# EAGLE design LTC6811_slave_12s_rev0 (EAGLE 9.3.1)

## Sheet 1 of 2
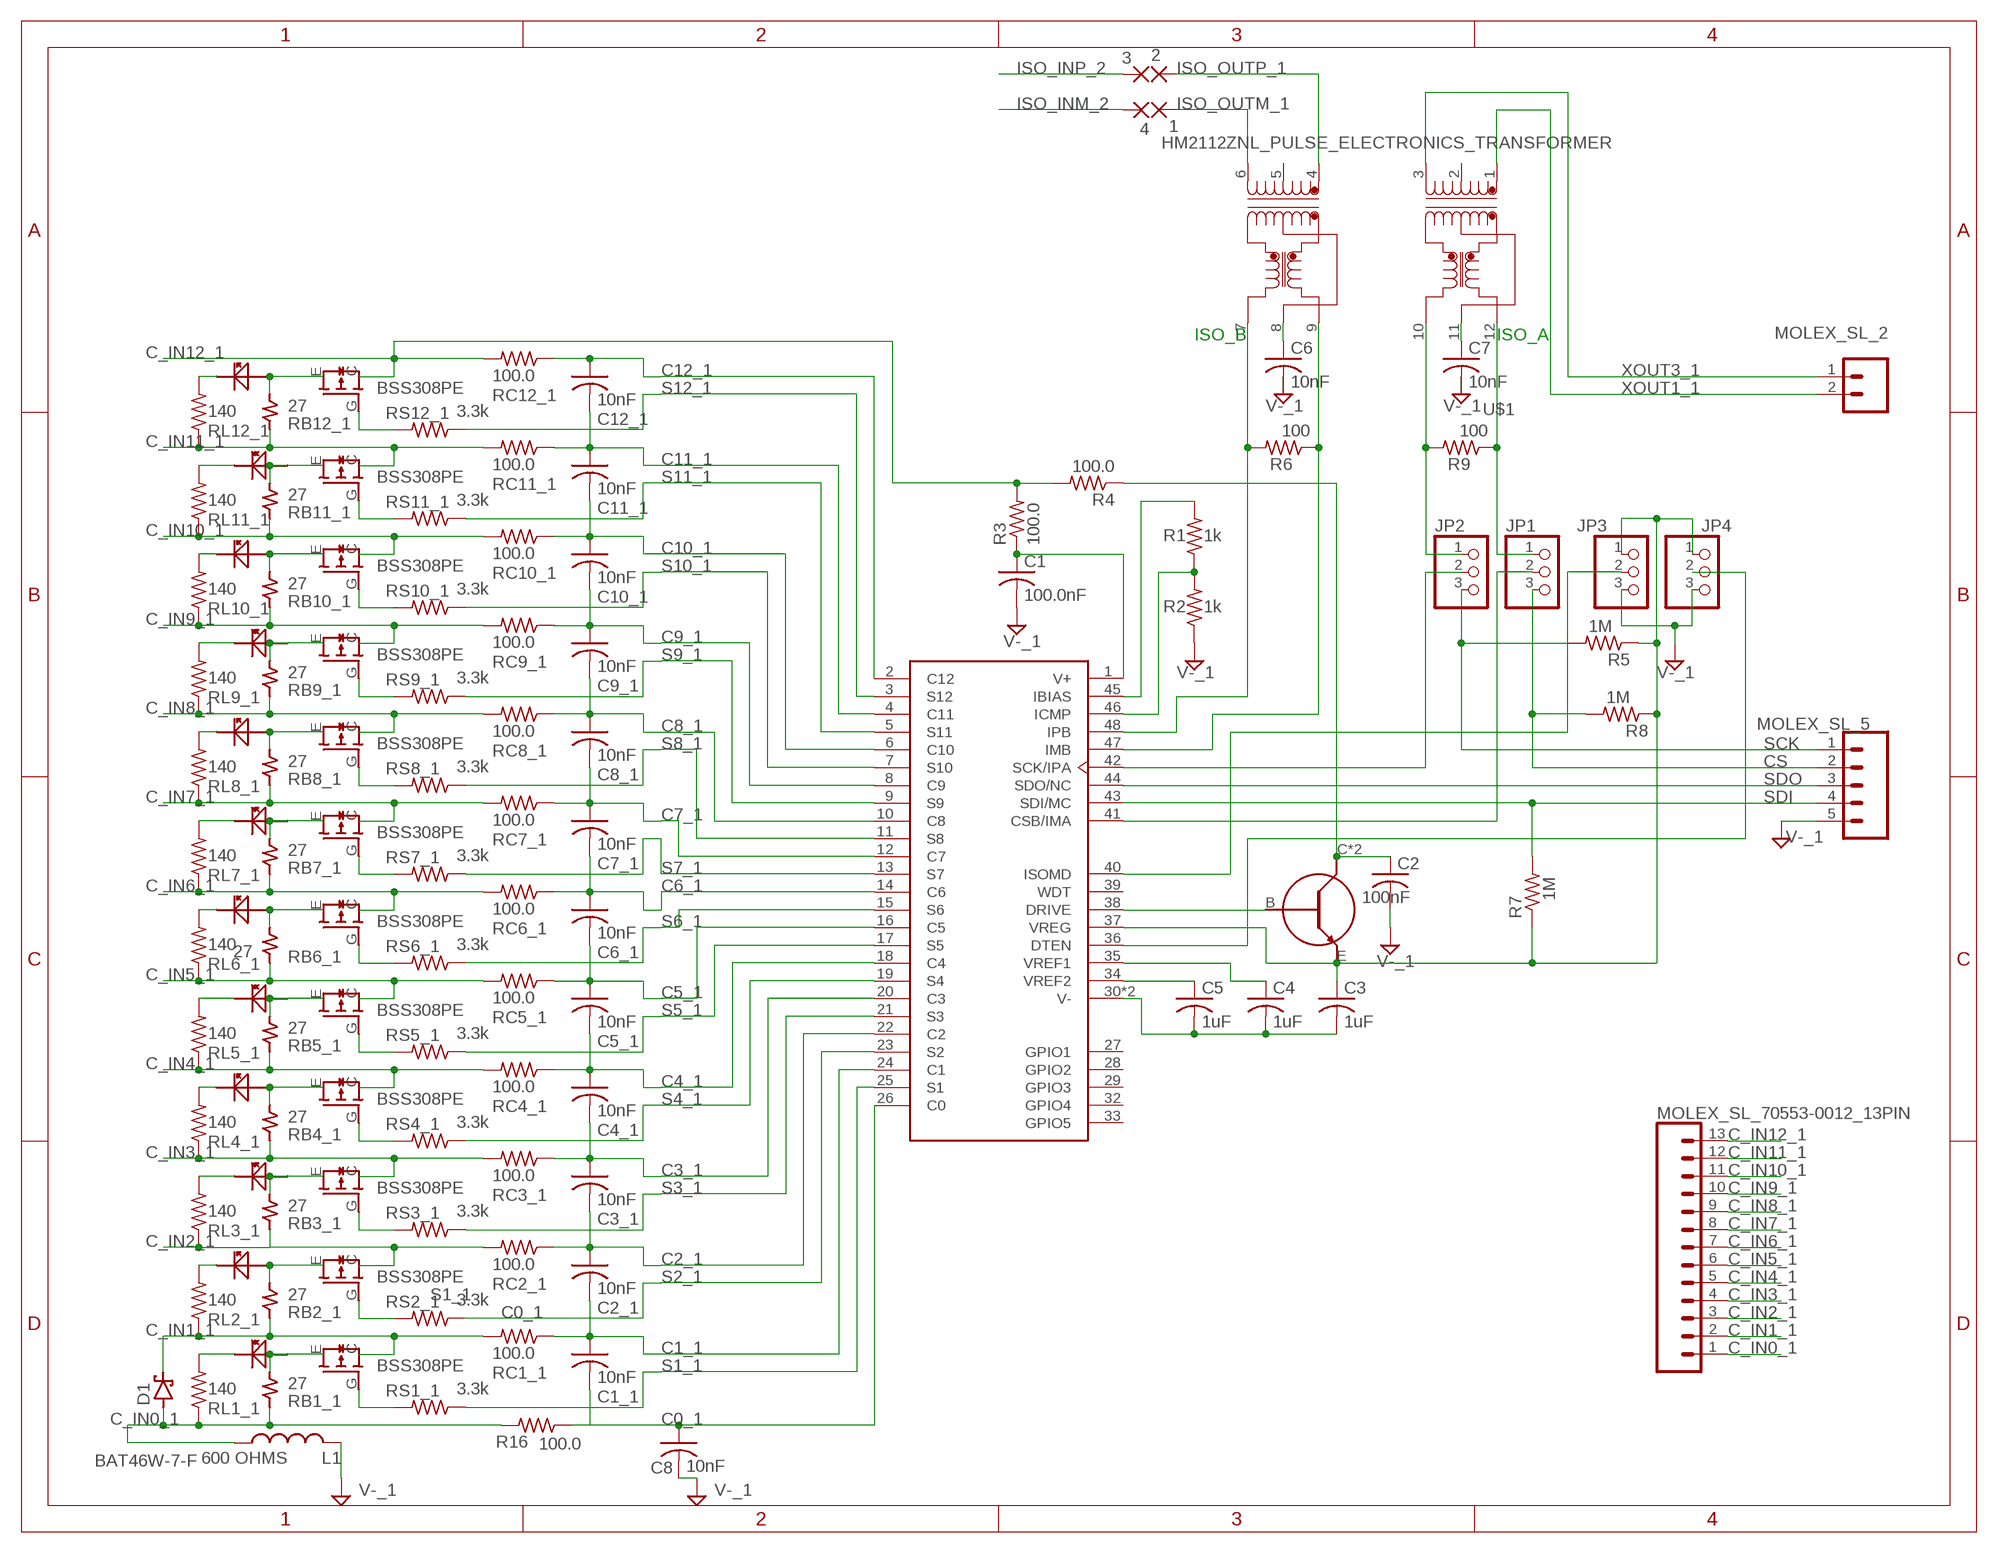
[diagram p0: schematic, sheet 1]

### Parts
1  WIREPAD2,15/1,0  [2,15/1,0]
2  WIREPAD2,15/1,0  [2,15/1,0]
3  WIREPAD2,15/1,0  [2,15/1,0]
4  WIREPAD2,15/1,0  [2,15/1,0]
C1  100.0nF  C-USC0805  [C0805]
C1_1  10nF  C-USC0805  [C0805]
C2  100nF  C-USC0805  [C0805]
C2_1  10nF  C-USC0805  [C0805]
C3  1uF  C-USC0805  [C0805]
C3_1  10nF  C-USC0805  [C0805]
C4  1uF  C-USC0805  [C0805]
C4_1  10nF  C-USC0805  [C0805]
C5  1uF  C-USC0805  [C0805]
C5_1  10nF  C-USC0805  [C0805]
C6  10nF  C-USC0805  [C0805]
C6_1  10nF  C-USC0805  [C0805]
C7  10nF  C-USC0805  [C0805]
C7_1  10nF  C-USC0805  [C0805]
C8  10nF  C-USC0805  [C0805]
C8_1  10nF  C-USC0805  [C0805]
C9_1  10nF  C-USC0805  [C0805]
C10_1  10nF  C-USC0805  [C0805]
C11_1  10nF  C-USC0805  [C0805]
C12_1  10nF  C-USC0805  [C0805]
D1  BAT46W-7-F  [SOD123]
DZT5551-13  DZT5551-13  [SOT223-4]
JP1  PINHD-1X3  [1X03]
JP2  PINHD-1X3  [1X03]
JP3  PINHD-1X3  [1X03]
JP4  PINHD-1X3  [1X03]
L1  600 OHMS  0805_FERRITEBEAD_INDUCTOR  [0805_COMPONENT]
LED1_3  LED_0805  [0805_COMPONENT]
LED1_4  LED_0805  [0805_COMPONENT]
LED1_5  LED_0805  [0805_COMPONENT]
LED1_6  LED_0805  [0805_COMPONENT]
LED1_7  LED_0805  [0805_COMPONENT]
LED1_8  LED_0805  [0805_COMPONENT]
LED1_9  LED_0805  [0805_COMPONENT]
LED1_10  LED_0805  [0805_COMPONENT]
LED1_11  LED_0805  [0805_COMPONENT]
LED1_12  LED_0805  [0805_COMPONENT]
LED1_13  LED_0805  [0805_COMPONENT]
LED1_14  LED_0805  [0805_COMPONENT]
MOLEX_SL_2  CONN_02  [1X02]
MOLEX_SL_5  CONN_05  [1X05]
MOLEX_SL_70553-0012_13PIN  CONN_13  [1X13]
R1  1k  R-US_R0805  [R0805]
R2  1k  R-US_R0805  [R0805]
R3  100.0  R-US_R0805  [R0805]
R4  100.0  R-US_R0805  [R0805]
R5  1M  R-US_R0805  [R0805]
R6  100  R-US_R0805  [R0805]
R7  1M  R-US_R0805  [R0805]
R8  1M  R-US_R0805  [R0805]
R9  100  R-US_R0805  [R0805]
R16  100.0  R-US_R0805  [R0805]
RB1_1  27  2817_RESISTOR  [2817_COMPONENT]
RB2_1  27  2817_RESISTOR  [2817_COMPONENT]
RB3_1  27  2817_RESISTOR  [2817_COMPONENT]
RB4_1  27  2817_RESISTOR  [2817_COMPONENT]
RB5_1  27  2817_RESISTOR  [2817_COMPONENT]
RB6_1  27  2817_RESISTOR  [2817_COMPONENT]
RB7_1  27  2817_RESISTOR  [2817_COMPONENT]
RB8_1  27  2817_RESISTOR  [2817_COMPONENT]
RB9_1  27  2817_RESISTOR  [2817_COMPONENT]
RB10_1  27  2817_RESISTOR  [2817_COMPONENT]
RB11_1  27  2817_RESISTOR  [2817_COMPONENT]
RB12_1  27  2817_RESISTOR  [2817_COMPONENT]
RC1_1  100.0  R-US_R0805  [R0805]
RC2_1  100.0  R-US_R0805  [R0805]
RC3_1  100.0  R-US_R0805  [R0805]
RC4_1  100.0  R-US_R0805  [R0805]
RC5_1  100.0  R-US_R0805  [R0805]
RC6_1  100.0  R-US_R0805  [R0805]
RC7_1  100.0  R-US_R0805  [R0805]
RC8_1  100.0  R-US_R0805  [R0805]
RC9_1  100.0  R-US_R0805  [R0805]
RC10_1  100.0  R-US_R0805  [R0805]
RC11_1  100.0  R-US_R0805  [R0805]
RC12_1  100.0  R-US_R0805  [R0805]
RL1_1  140  R-US_R0805  [R0805]
RL2_1  140  R-US_R0805  [R0805]
RL3_1  140  R-US_R0805  [R0805]
RL4_1  140  R-US_R0805  [R0805]
RL5_1  140  R-US_R0805  [R0805]
RL6_1  140  R-US_R0805  [R0805]
RL7_1  140  R-US_R0805  [R0805]
RL8_1  140  R-US_R0805  [R0805]
RL9_1  140  R-US_R0805  [R0805]
RL10_1  140  R-US_R0805  [R0805]
RL11_1  140  R-US_R0805  [R0805]
RL12_1  140  R-US_R0805  [R0805]
RS1_1  3.3k  R-US_R0805  [R0805]
RS2_1  3.3k  R-US_R0805  [R0805]
RS3_1  3.3k  R-US_R0805  [R0805]
RS4_1  3.3k  R-US_R0805  [R0805]
RS5_1  3.3k  R-US_R0805  [R0805]
RS6_1  3.3k  R-US_R0805  [R0805]
RS7_1  3.3k  R-US_R0805  [R0805]
RS8_1  3.3k  R-US_R0805  [R0805]
RS9_1  3.3k  R-US_R0805  [R0805]
RS10_1  3.3k  R-US_R0805  [R0805]
RS11_1  3.3k  R-US_R0805  [R0805]
RS12_1  3.3k  R-US_R0805  [R0805]
T1_3  BSS308PEH6327  [SOT23]
T1_4  BSS308PEH6327  [SOT23]
T1_5  BSS308PEH6327  [SOT23]
T1_6  BSS308PEH6327  [SOT23]
T1_7  BSS308PEH6327  [SOT23]
T1_8  BSS308PEH6327  [SOT23]
T1_9  BSS308PEH6327  [SOT23]
T1_10  BSS308PEH6327  [SOT23]
T1_11  BSS308PEH6327  [SOT23]
T1_12  BSS308PEH6327  [SOT23]
T1_13  BSS308PEH6327  [SOT23]
T1_14  BSS308PEH6327  [SOT23]
U1  LTC6811HG-2#PBF  [LTC6811-1]
U$1  HM2112ZNL_PULSE_ELECTRONICS_TRANSFORMER  [HM2112ZNL_12SMT]

### Nets
C0_1: C8.1 R16.1 U1.26(C0)
C1_1: C1_1.1 C2_1.2 RC1_1.1 U1.24(C1)
C2_1: C2_1.1 C3_1.2 RC2_1.1 U1.22(C2)
C3_1: C3_1.1 C4_1.2 RC3_1.1 U1.20(C3)
C4_1: C4_1.1 C5_1.2 RC4_1.1 U1.18(C4)
C5_1: C5_1.1 C6_1.2 RC5_1.1 U1.16(C5)
C6_1: C6_1.1 C7_1.2 RC6_1.1 U1.14(C6)
C7_1: C7_1.1 C8_1.2 RC7_1.1 U1.12(C7)
C8_1: C8_1.1 C9_1.2 RC8_1.1 U1.10(C8)
C9_1: C9_1.1 C10_1.2 RC9_1.1 U1.8(C9)
C10_1: C10_1.1 C11_1.2 RC10_1.1 U1.6(C10)
C11_1: C11_1.1 C12_1.2 RC11_1.1 U1.4(C11)
C12_1: C12_1.1 RC12_1.1 U1.2(C12)
C_IN0_1: D1.A L1.1 MOLEX_SL_70553-0012_13PIN.1 R16.2 RB1_1.2 RL1_1.1
C_IN1_1: D1.C MOLEX_SL_70553-0012_13PIN.2 RB2_1.2 RC1_1.2 RL2_1.1 T1_3.C
C_IN2_1: MOLEX_SL_70553-0012_13PIN.3 RB3_1.2 RC2_1.2 RL3_1.1 T1_4.C
C_IN3_1: MOLEX_SL_70553-0012_13PIN.4 RB4_1.2 RC3_1.2 RL4_1.1 T1_7.C
C_IN4_1: MOLEX_SL_70553-0012_13PIN.5 RB5_1.2 RC4_1.2 RL5_1.1 T1_8.C
C_IN5_1: MOLEX_SL_70553-0012_13PIN.6 RB6_1.2 RC5_1.2 RL6_1.1 T1_5.C
C_IN6_1: MOLEX_SL_70553-0012_13PIN.7 RB7_1.2 RC6_1.2 RL7_1.1 T1_6.C
C_IN7_1: MOLEX_SL_70553-0012_13PIN.8 RB8_1.2 RC7_1.2 RL8_1.1 T1_9.C
C_IN8_1: MOLEX_SL_70553-0012_13PIN.9 RB9_1.2 RC8_1.2 RL9_1.1 T1_10.C
C_IN9_1: MOLEX_SL_70553-0012_13PIN.10 RB10_1.2 RC9_1.2 RL10_1.1 T1_11.C
C_IN10_1: MOLEX_SL_70553-0012_13PIN.11 RB11_1.2 RC10_1.2 RL11_1.1 T1_12.C
C_IN11_1: MOLEX_SL_70553-0012_13PIN.12 RB12_1.2 RC11_1.2 RL12_1.1 T1_13.C
C_IN12_1: MOLEX_SL_70553-0012_13PIN.13 R3.2 R4.2 RC12_1.2 T1_14.C
CS: JP1.3 MOLEX_SL_5.2 R8.2
CS_OR_IMA: JP1.2 U1.41(CSB/IMA)
DRIVE: DZT5551-13.B U1.38(DRIVE)
DTEN: JP4.2 U1.36(DTEN)
IBIAS: R1.2 U1.45(IBIAS)
ICMP: R1.1 R2.2 U1.46(ICMP)
IMB: R6.1 U1.47(IMB) U$1.9
IPB: R6.2 U1.48(IPB) U$1.7
ISO_INM_2: 4.1(P)
ISO_INP_2: 3.1(P)
ISO_OUTM_1: 1.1(P) U$1.6
ISO_OUTP_1: 2.1(P) U$1.4
ISOMD: JP3.2 U1.40(ISOMD)
N$3: C6.1 U$1.8
N$5: C1.1 R3.1 U1.1(V+)
N$7: JP2.1 R9.2 U$1.10
N$8: JP1.1 R9.1 U$1.12
N$9: C7.1 U$1.11
N$32: LED1_11.2 RB9_1.1 T1_11.E
N$33: RS9_1.2 T1_11.G(B)
N$34: LED1_11.1 RL9_1.2
N$35: LED1_12.2 RB10_1.1 T1_12.E
N$36: RS10_1.2 T1_12.G(B)
N$37: LED1_12.1 RL10_1.2
N$39: LED1_13.2 RB11_1.1 T1_13.E
N$40: LED1_3.2 RB1_1.1 T1_3.E
N$41: RS1_1.2 T1_3.G(B)
N$42: LED1_3.1 RL1_1.2
N$43: LED1_4.2 RB2_1.1 T1_4.E
N$44: RS2_1.2 T1_4.G(B)
N$45: LED1_4.1 RL2_1.2
N$46: C1_1.2
N$48: LED1_5.2 RB5_1.1 T1_5.E
N$49: RS5_1.2 T1_5.G(B)
N$50: LED1_5.1 RL5_1.2
N$51: LED1_6.2 RB6_1.1 T1_6.E
N$52: RS6_1.2 T1_6.G(B)
N$53: LED1_6.1 RL6_1.2
N$55: LED1_9.2 RB7_1.1 T1_9.E
N$56: LED1_7.2 RB3_1.1 T1_7.E
N$57: RS3_1.2 T1_7.G(B)
N$58: LED1_7.1 RL3_1.2
N$59: LED1_8.2 RB4_1.1 T1_8.E
N$60: RS4_1.2 T1_8.G(B)
N$61: LED1_8.1 RL4_1.2
N$62: RS11_1.2 T1_13.G(B)
N$63: RS7_1.2 T1_9.G(B)
N$64: LED1_9.1 RL7_1.2
N$65: LED1_10.2 RB8_1.1 T1_10.E
N$66: RS8_1.2 T1_10.G(B)
N$67: LED1_10.1 RL8_1.2
N$69: LED1_13.1 RL11_1.2
N$70: LED1_14.2 RB12_1.1 T1_14.E
N$71: RS12_1.2 T1_14.G(B)
N$72: LED1_14.1 RL12_1.2
S1_1: RS1_1.1 U1.25(S1)
S2_1: RS2_1.1 U1.23(S2)
S3_1: RS3_1.1 U1.21(S3)
S4_1: RS4_1.1 U1.19(S4)
S5_1: RS5_1.1 U1.17(S5)
S6_1: RS6_1.1 U1.15(S6)
S7_1: RS7_1.1 U1.13(S7)
S8_1: RS8_1.1 U1.11(S8)
S9_1: RS9_1.1 U1.9(S9)
S10_1: RS10_1.1 U1.7(S10)
S11_1: RS11_1.1 U1.5(S11)
S12_1: RS12_1.1 U1.3(S12)
SCK: JP2.3 MOLEX_SL_5.1 R5.2
SCK_OR_IPA: JP2.2 U1.42(SCK/IPA)
SDI: MOLEX_SL_5.4 R7.2 U1.43(SDI/MC)
SDO: MOLEX_SL_5.3 U1.44(SDO/NC)
V-_1: C1.2 C2.2 C3.2 C4.2 C5.2 C6.2 C7.2 C8.2 JP3.3 JP4.3 L1.2 MOLEX_SL_5.5 R2.1 U1.30(V-) U1.31(V-) ; supply symbol labelled GND
VREF1_C4: C4.1 U1.35(VREF1)
VREF2_C5: C5.1 U1.34(VREF2)
VREG: C3.1 DZT5551-13.E JP3.1 JP4.1 R5.1 R7.1 R8.1 U1.37(VREG)
VREG_CAP: C2.1 DZT5551-13.C DZT5551-13.C@2(C) R4.1
XOUT1_1: MOLEX_SL_2.2 U$1.1
XOUT3_1: MOLEX_SL_2.1 U$1.3
Unconnected: U1.27(GPIO1) U1.28(GPIO2) U1.29(GPIO3) U1.32(GPIO4) U1.33(GPIO5) U1.39(WDT) U$1.2 U$1.5

### Notes on the sheet
- ISO_B | ISO_A

## Sheet 2 of 2

## Library data of the parts
1-4 = wirepad:WIREPAD: Wire PAD connect wire on PCB
C1 C1_1 C2 C2_1 C3 C3_1 C4 C4_1 C5 C5_1 C6 C6_1 C7 C7_1 C8 C8_1 C9_1 C10_1 C11_1 C12_1 = resistor:C-US: CAPACITOR, American symbol
D1 = Library_Capstone:BAT46W-7-F
DZT5551-13 = Library_Capstone:DZT5551-13
JP1-JP4 = pinhead:PINHD-1X3: PIN HEADER
L1 = Library_Capstone:0805_FERRITEBEAD_INDUCTOR
LED1_3-LED1_14 = Library_Capstone:LED_0805
MOLEX_SL_2 = SparkFun-Connectors:CONN_02: Multi connection point. Often used as Generic Header-pin footprint for 0.1 inch spaced/style header connections On any of the 0.1 inch spaced packages, you can populate with these: Break Away Headers - Straight <https://www.sparkfun.com/products/116> (PRT-00116) Break Away Male Headers - Right Angle <https://www.sparkfun.com/products/553> (PRT-00553) Female Headers <https://www.sparkfun.com/products/115> (PRT-00115) Break Away Headers - Machine Pin <https://www.sparkfun.com/products/117> (PRT-00117) Break Away Female Headers - Swiss Machine Pin <https://www.sparkfun.com/products/743> (PRT-00743) For SCREWTERMINALS and SPRING TERMINALS visit here: Screw Terimnals on SparkFun.com <https://www.sparkfun.com/search/results?term=Screw+Terminals> (5mm/3.5mm/2.54mm spacing) This device is also useful as a general connection point to wire up your design to another part of your project. Our various solder wires solder well into these plated through hole pads. Hook-Up Wire - Assortment (Stranded, 22 AWG) <https://www.sparkfun.com/products/11375> (PRT-11375) Hook-Up Wire - Assortment (Solid Core, 22 AWG) <https://www.sparkfun.com/products/11367> (PRT-11367) View the entire wire category on our website here <https://www.sparkfun.com/categories/141> Special notes: Molex polarized connector foot print use with: PRT-08233 with associated crimp pins and housings. 2.54_SCREWTERM for use with PRT-10571. 3.5mm Screw Terminal footprints for PRT-08084 5mm Screw Terminal footprints for use with PRT-08432
MOLEX_SL_5 = SparkFun-Connectors:CONN_05: Multi connection point. Often used as Generic Header-pin footprint for 0.1 inch spaced/style header connections On any of the 0.1 inch spaced packages, you can populate with these: Break Away Headers - Straight <https://www.sparkfun.com/products/116> (PRT-00116) Break Away Male Headers - Right Angle <https://www.sparkfun.com/products/553> (PRT-00553) Female Headers <https://www.sparkfun.com/products/115> (PRT-00115) Break Away Headers - Machine Pin <https://www.sparkfun.com/products/117> (PRT-00117) Break Away Female Headers - Swiss Machine Pin <https://www.sparkfun.com/products/743> (PRT-00743) For SCREWTERMINALS and SPRING TERMINALS visit here: Screw Terimnals on SparkFun.com <https://www.sparkfun.com/search/results?term=Screw+Terminals> (5mm/3.5mm/2.54mm spacing) This device is also useful as a general connection point to wire up your design to another part of your project. Our various solder wires solder well into these plated through hole pads. Hook-Up Wire - Assortment (Stranded, 22 AWG) <https://www.sparkfun.com/products/11375> (PRT-11375) Hook-Up Wire - Assortment (Solid Core, 22 AWG) <https://www.sparkfun.com/products/11367> (PRT-11367) View the entire wire category on our website here <https://www.sparkfun.com/categories/141> Special notes: Molex polarized connector foot print use with SKU : PRT-08231 with associated crimp pins and housings. 1MM SMD Version SKU: PRT-10208
MOLEX_SL_70553-0012_13PIN = SparkFun-Connectors:CONN_13: Multi connection point. Often used as Generic Header-pin footprint for 0.1 inch spaced/style header connections On any of the 0.1 inch spaced packages, you can populate with these: Break Away Headers - Straight <https://www.sparkfun.com/products/116> (PRT-00116) Break Away Male Headers - Right Angle <https://www.sparkfun.com/products/553> (PRT-00553) Female Headers <https://www.sparkfun.com/products/115> (PRT-00115) Break Away Headers - Machine Pin <https://www.sparkfun.com/products/117> (PRT-00117) Break Away Female Headers - Swiss Machine Pin <https://www.sparkfun.com/products/743> (PRT-00743) For SCREWTERMINALS and SPRING TERMINALS visit here: Screw Terimnals on SparkFun.com <https://www.sparkfun.com/search/results?term=Screw+Terminals> (5mm/3.5mm/2.54mm spacing) This device is also useful as a general connection point to wire up your design to another part of your project. Our various solder wires solder well into these plated through hole pads. Hook-Up Wire - Assortment (Stranded, 22 AWG) <https://www.sparkfun.com/products/11375> (PRT-11375) Hook-Up Wire - Assortment (Solid Core, 22 AWG) <https://www.sparkfun.com/products/11367> (PRT-11367) View the entire wire category on our website here <https://www.sparkfun.com/categories/141> Special notes: Molex polarized connector foot print use with SKU : PRT-08231 with associated crimp pins and housings. 1MM SMD Version SKU: PRT-10208 NOTES ON THE VARIANTS LOCK and LOCK_LONGPADS... This footprint was designed to help hold the alignment of a through-hole component (i.e. 6-pin header) while soldering it into place. You may notice that each hole has been shifted either up or down by 0.005 of an inch from it's more standard position (which is a perfectly straight line). This slight alteration caused the pins (the squares in the middle) to touch the edges of the holes. Because they are alternating, it causes a "brace" to hold the component in place. 0.005 has proven to be the perfect amount of "off-center" position when using our standard breakaway headers. Although looks a little odd when you look at the bare footprint, once you have a header in there, the alteration is very hard to notice. Also,if you push a header all the way into place, it is covered up entirely on the bottom side.
R1-R9 R16 RC1_1 RC2_1 RC3_1 RC4_1 RC5_1 RC6_1 RC7_1 RC8_1 RC9_1 RC10_1 RC11_1 RC12_1 RL1_1 RL2_1 RL3_1 RL4_1 RL5_1 RL6_1 RL7_1 RL8_1 RL9_1 RL10_1 RL11_1 RL12_1 RS1_1 RS2_1 RS3_1 RS4_1 RS5_1 RS6_1 RS7_1 RS8_1 RS9_1 RS10_1 RS11_1 RS12_1 = resistor:R-US_: RESISTOR, American symbol
RB1_1 RB2_1 RB3_1 RB4_1 RB5_1 RB6_1 RB7_1 RB8_1 RB9_1 RB10_1 RB11_1 RB12_1 = Library_Capstone:2817_RESISTOR
T1_3-T1_14 = Library_Capstone:BSS308PEH6327
U1 = LTC6811HG-2_PBF:LTC6811HG-2#PBF: LTC6811-1/LTC6811-2 - Multicell Battery Monitors; AVAILABILITY: Unavailable; DESCRIPTION: LTC6811-1/LTC6811-2 - Multicell Battery Monitors; MF: Linear Technology/Analog; MP: LTC6811HG-2#PBF; PACKAGE: SSOP-48 Linear Technology; PRICE: None
U$1 = HM2112ZNL:HM2112ZNL_PULSE_ELECTRONICS_TRANSFORMER

## Board
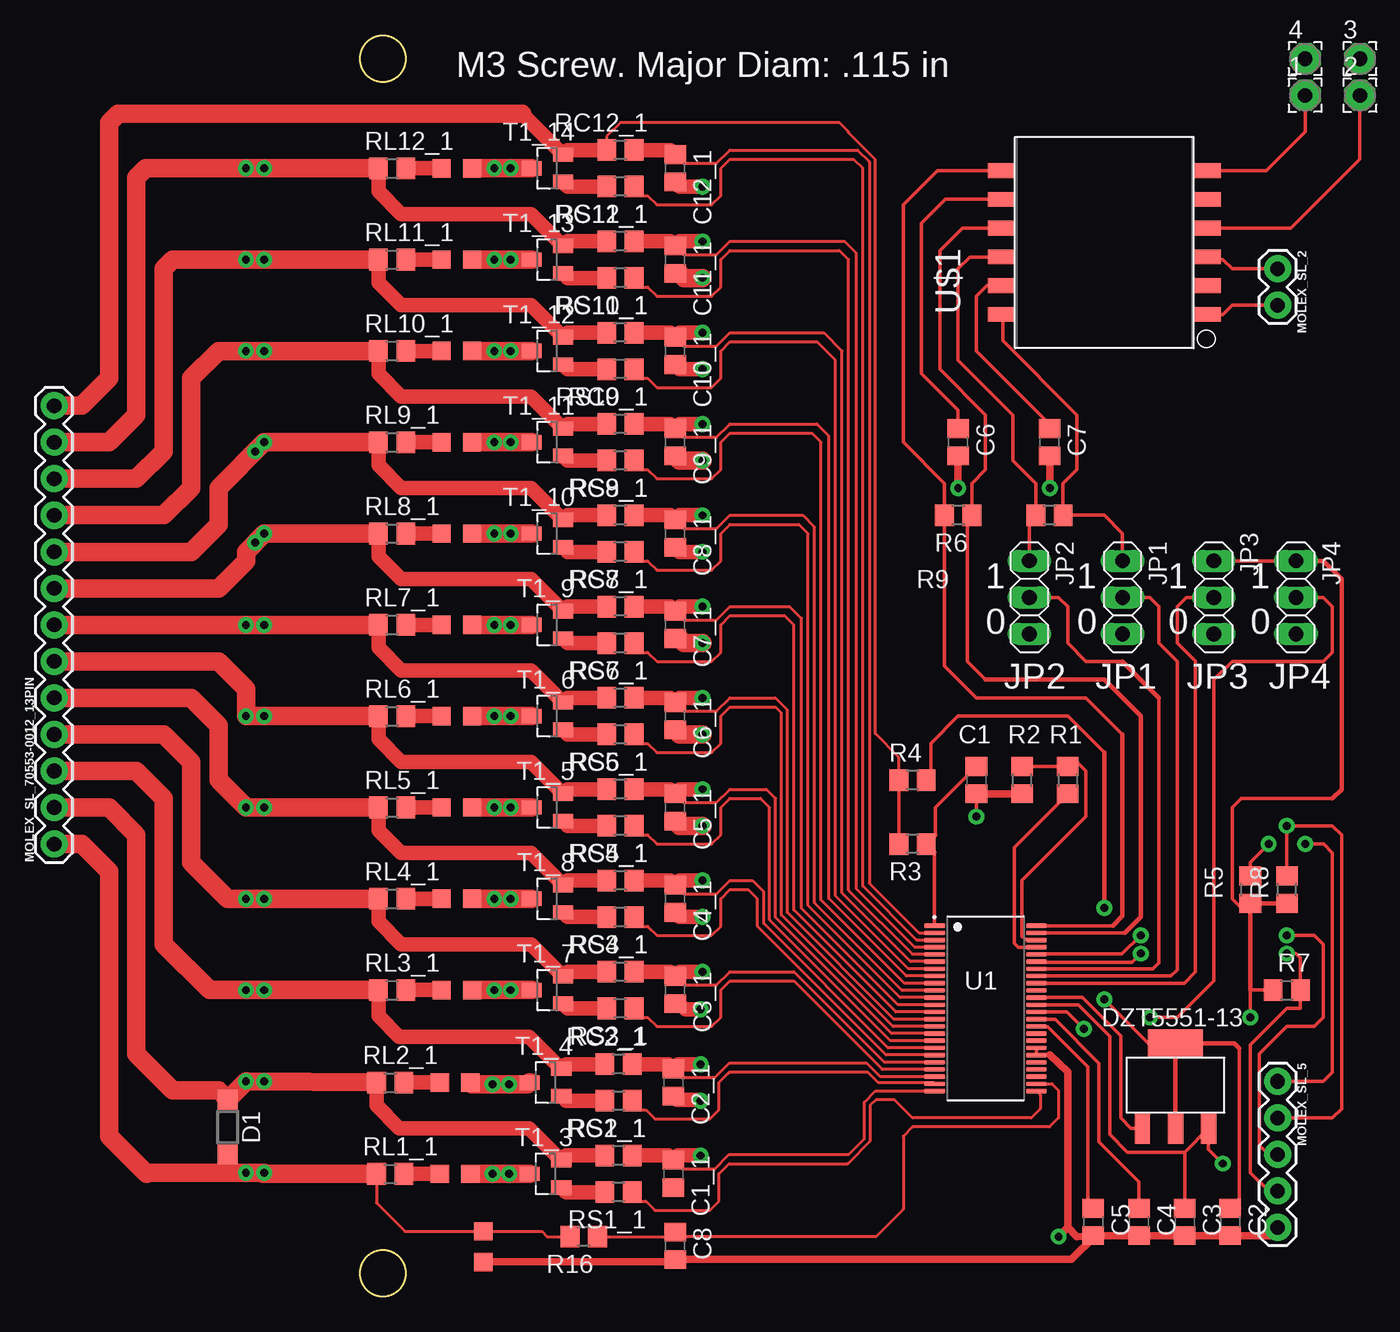
[diagram p1: board, top side]
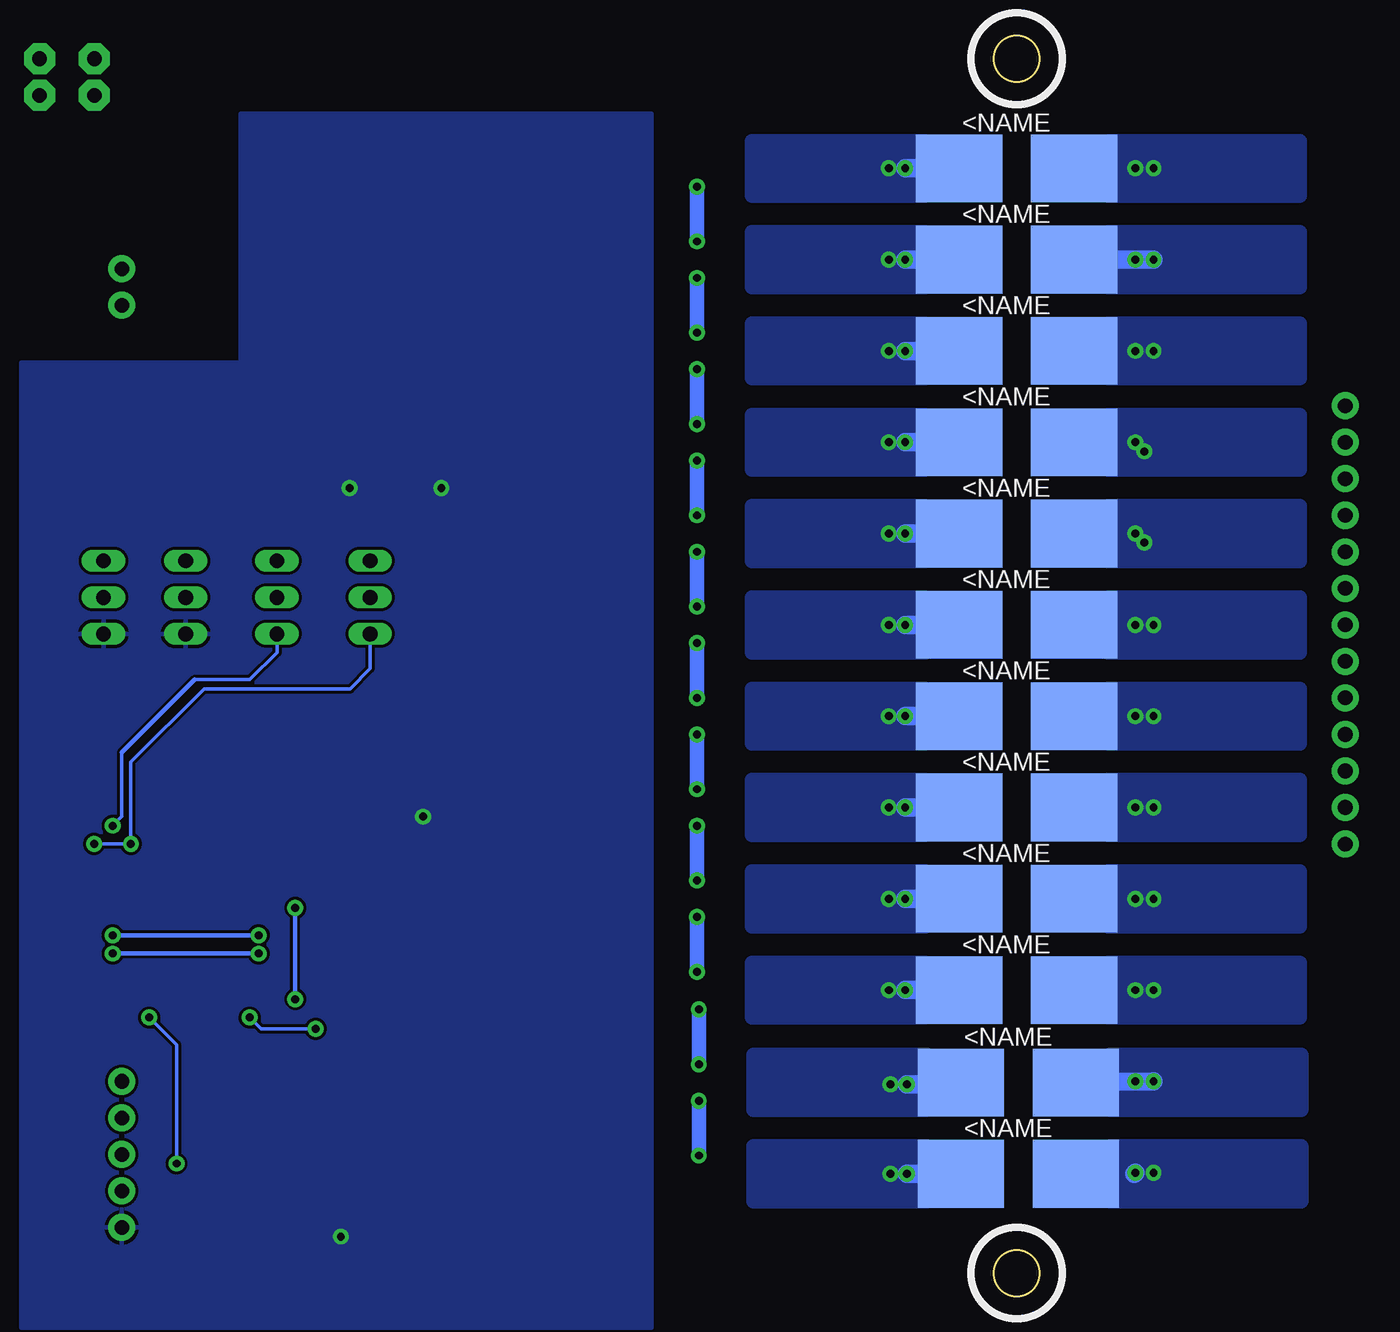
[diagram p2: board, bottom side, seen from below]

Size 3.18 x 87.63 mm. Coordinates in mm from the lower left corner, seen from the top.
Outline: circle at 1.59,86.04 radius 1.59
Outline: circle at 1.59,1.59 radius 1.59
Copper layers (1*16): Top 0.035mm / dielectric 1.5mm / Bottom 0.035mm
Design rules "default *": minimum track width 6mil, minimum drill 0.53mm, track to track 8mil, track to pad 6mil, pad to pad 6mil, via to via 6mil, smd to smd 6mil, copper to edge 40mil, drill to drill 6mil, minimum pad ring 10mil, minimum via ring 8mil, stop-mask expansion 4mil, vias tented up to drill 0mil, thermal gap 10mil

### Footprints (pad centres in the part's own frame; a part is rotated, then mirrored left to right if it is on the bottom)
2,15/1,0 = drill 1.016 pad 2.159 octagon: 1 0,0
C0805 = smd 1.3 x 1.5: 1 -0.95,0; 2 0.95,0
SOD123 = smd 1.4 x 1.4: A 1.9,0; C -1.9,0
SOT223-4 = smd 1.067 x 2.184: B -2.3,-3; C@2 0,-3; E 2.3,-3 | smd 3.81 x 1.93: C 0,2.9
1X03 = drill 1.016 long: 1 -2.54,0; 2 0,0; 3 2.54,0
0805_COMPONENT = smd 1.27 x 1.27: 1 -1,0; 2 1.127,0
1X02 = drill 1.016 pad 1.88: 1 0,0; 2 2.54,0
1X05 = drill 1.016 pad 1.88: 1 0,0; 2 2.54,0; 3 5.08,0; 4 7.62,0; 5 10.16,0
1X13 = drill 1.016 pad 1.88: 1 0,0; 2 2.54,0; 3 5.08,0; 4 7.62,0; 5 10.16,0; 6 12.7,0; 7 15.24,0; 8 17.78,0; 9 20.32,0; 10 22.86,0; 11 25.4,0; 12 27.94,0; 13 30.48,0
R0805 = smd 1.3 x 1.5: 1 -0.95,0; 2 0.95,0
2817_COMPONENT = smd 6 x 4.7: 1 -4,0; 2 4,0
SOT23 = smd 1 x 1.4: C 0.95,-1.1; E 0,1.1; G -0.95,-1.1
LTC6811-1 = smd 1.44 x 0.34: 1 -3.54,5.75; 2 -3.54,5.25; 3 -3.54,4.75; 4 -3.54,4.25; 5 -3.54,3.75; 6 -3.54,3.25; 7 -3.54,2.75; 8 -3.54,2.25; 9 -3.54,1.75; 10 -3.54,1.25; 11 -3.54,0.75; 12 -3.54,0.25; 13 -3.54,-0.25; 14 -3.54,-0.75; 15 -3.54,-1.25; 16 -3.54,-1.75; 17 -3.54,-2.25; 18 -3.54,-2.75; 19 -3.54,-3.25; 20 -3.54,-3.75; 21 -3.54,-4.25; 22 -3.54,-4.75; 23 -3.54,-5.25; 24 -3.54,-5.75; 25 3.54,-5.75; 26 3.54,-5.25; 27 3.54,-4.75; 28 3.54,-4.25; 29 3.54,-3.75; 30 3.54,-3.25; 31 3.54,-2.75; 32 3.54,-2.25; 33 3.54,-1.75; 34 3.54,-1.25; 35 3.54,-0.75; 36 3.54,-0.25; 37 3.54,0.25; 38 3.54,0.75; 39 3.54,1.25; 40 3.54,1.75; 41 3.54,2.25; 42 3.54,2.75; 43 3.54,3.25; 44 3.54,3.75; 45 3.54,4.25; 46 3.54,4.75; 47 3.54,5.25; 48 3.54,5.75
HM2112ZNL_12SMT = smd 1.02 x 1.89: 1 0,-7.145; 2 2,-7.145; 3 4,-7.145; 4 6,-7.145; 5 8,-7.145; 6 10,-7.145; 7 10,7.145; 8 8,7.145; 9 6,7.145; 10 4,7.145; 11 2,7.145; 12 0,7.145

### Placement (x,y rotation side)
1  65.72,83.5 0 top  (outside the outline)
2  69.53,83.5 0 top  (outside the outline)
3  69.53,86.04 0 top  (outside the outline)
4  65.72,86.04 0 top  (outside the outline)
C1  42.86,35.88 270 top  (outside the outline)
C1_1  21.78,8.5 270 top  (outside the outline)
C2  60.52,5.14 270 top  (outside the outline)
C2_1  21.78,14.85 270 top  (outside the outline)
C3  57.34,5.14 270 top  (outside the outline)
C3_1  21.91,21.27 270 top  (outside the outline)
C4  54.17,5.14 270 top  (outside the outline)
C4_1  21.91,27.62 270 top  (outside the outline)
C5  50.99,5.14 270 top  (outside the outline)
C5_1  21.91,33.97 270 top  (outside the outline)
C6  41.59,59.37 270 top  (outside the outline)
C6_1  21.91,40.32 270 top  (outside the outline)
C7  47.94,59.37 270 top  (outside the outline)
C7_1  21.91,46.67 270 top  (outside the outline)
C8  21.91,3.49 270 top  (outside the outline)
C8_1  21.91,53.02 270 top  (outside the outline)
C9_1  21.91,59.37 270 top  (outside the outline)
C10_1  21.91,65.72 270 top  (outside the outline)
C11_1  21.91,72.07 270 top  (outside the outline)
C12_1  21.91,78.42 270 top  (outside the outline)
D1  -9.21,11.75 270 top  (outside the outline)
DZT5551-13  56.71,14.67 0 top  (outside the outline)
JP1  53.02,48.58 270 top  (outside the outline)
JP2  46.55,48.58 270 top  (outside the outline)
JP3  59.37,48.58 270 top  (outside the outline)
JP4  65.09,48.58 270 top  (outside the outline)
L1  8.57,3.49 270 top  (outside the outline)
LED1_3  6.54,8.5 0 top
LED1_4  6.54,14.85 0 top
LED1_5  6.67,33.97 0 top
LED1_6  6.67,40.32 0 top
LED1_7  6.67,21.27 0 top
LED1_8  6.67,27.62 0 top
LED1_9  6.67,46.67 0 top
LED1_10  6.67,53.02 0 top
LED1_11  6.67,59.37 0 top
LED1_12  6.67,65.72 0 top
LED1_13  6.67,72.07 0 top
LED1_14  6.67,78.42 0 top
MOLEX_SL_2  63.82,71.44 270 top  (outside the outline)
MOLEX_SL_5  63.82,14.92 270 top  (outside the outline)
MOLEX_SL_70553-0012_13PIN  -21.27,31.43 90 top  (outside the outline)
R1  49.21,35.88 270 top  (outside the outline)
R2  46.04,35.88 90 top  (outside the outline)
R3  38.42,31.43 180 top  (outside the outline)
R4  38.42,35.88 180 top  (outside the outline)
R5  61.91,28.26 90 top  (outside the outline)
R6  41.59,54.29 180 top  (outside the outline)
R7  64.45,21.27 0 top  (outside the outline)
R8  64.45,28.26 90 top  (outside the outline)
R9  47.94,54.29 180 top  (outside the outline)
R16  15.56,4.13 180 top  (outside the outline)
RB1_1  1.46,8.5 0 bottom
RB2_1  1.46,14.85 0 bottom
RB3_1  1.59,21.27 0 bottom
RB4_1  1.59,27.62 0 bottom
RB5_1  1.59,33.97 0 bottom
RB6_1  1.59,40.32 0 bottom
RB7_1  1.59,46.67 0 bottom
RB8_1  1.59,53.02 0 bottom
RB9_1  1.59,59.37 0 bottom
RB10_1  1.59,65.72 0 bottom
RB11_1  1.59,72.07 0 bottom
RB12_1  1.59,78.42 0 bottom
RC1_1  17.97,9.77 180 top  (outside the outline)
RC2_1  17.97,16.12 180 top  (outside the outline)
RC3_1  18.1,22.54 180 top  (outside the outline)
RC4_1  18.1,28.89 180 top  (outside the outline)
RC5_1  18.1,35.24 180 top  (outside the outline)
RC6_1  18.1,41.59 180 top  (outside the outline)
RC7_1  18.1,47.94 180 top  (outside the outline)
RC8_1  18.1,54.29 180 top  (outside the outline)
RC9_1  18.1,60.64 180 top  (outside the outline)
RC10_1  18.1,66.99 180 top  (outside the outline)
RC11_1  18.1,73.34 180 top  (outside the outline)
RC12_1  18.1,79.69 180 top  (outside the outline)
RL1_1  2.1,8.5 0 top
RL2_1  2.1,14.85 0 top
RL3_1  2.22,21.27 0 top
RL4_1  2.22,27.62 0 top
RL5_1  2.22,33.97 0 top
RL6_1  2.22,40.32 0 top
RL7_1  2.22,46.67 0 top
RL8_1  2.22,53.02 0 top
RL9_1  2.22,59.37 0 top
RL10_1  2.22,65.72 0 top
RL11_1  2.22,72.07 0 top
RL12_1  2.22,78.42 0 top
RS1_1  17.97,7.23 180 top  (outside the outline)
RS2_1  17.97,13.58 180 top  (outside the outline)
RS3_1  18.1,20 180 top  (outside the outline)
RS4_1  18.1,26.35 180 top  (outside the outline)
RS5_1  18.1,32.7 180 top  (outside the outline)
RS6_1  18.1,39.05 180 top  (outside the outline)
RS7_1  18.1,45.4 180 top  (outside the outline)
RS8_1  18.1,51.75 180 top  (outside the outline)
RS9_1  18.1,58.1 180 top  (outside the outline)
RS10_1  18.1,64.45 180 top  (outside the outline)
RS11_1  18.1,70.8 180 top  (outside the outline)
RS12_1  18.1,77.15 180 top  (outside the outline)
T1_3  12.89,8.5 90 top  (outside the outline)
T1_4  12.89,14.85 90 top  (outside the outline)
T1_5  13.02,33.97 90 top  (outside the outline)
T1_6  13.02,40.32 90 top  (outside the outline)
T1_7  13.02,21.27 90 top  (outside the outline)
T1_8  13.02,27.62 90 top  (outside the outline)
T1_9  13.02,46.67 90 top  (outside the outline)
T1_10  13.02,53.02 90 top  (outside the outline)
T1_11  13.02,59.37 90 top  (outside the outline)
T1_12  13.02,65.72 90 top  (outside the outline)
T1_13  13.02,72.07 90 top  (outside the outline)
T1_14  13.02,78.42 90 top  (outside the outline)
U1  43.5,20 0 top  (outside the outline)
U$1  51.75,68.26 90 top  (outside the outline)

### Tracks (layer width: path | path; a pad name or v marks a point on that pad's centre or on a via)
C0_1
  Top 0.203: U1.26 48.11,14.75 48.58,14.29 48.58,12.38 47.94,11.75 38.42,11.75 37.78,11.11 37.78,6.03 35.88,4.13 22.22,4.13 C8.1 21.59,4.13 R16.1
C1_1  (via drill 0.55 pad 1.1)
  Top 0.203: C1_1.1 22.42,8.81 24.64,8.81 25.67,9.84 33.98,9.84 35.06,10.92 35.06,13.47 35.84,14.25 U1.24
  Top 1.016: RC1_1.1 21.46,9.77 C1_1.1 22.1,9.77 v23.69,9.77 | C2_1.2 22.02,13.65 23.61,13.65 v23.69,13.58
  Bottom 1.016: v23.69,9.77 v23.69,13.58
C2_1  (via drill 0.55 pad 1.1)
  Top 0.203: C2_1.1 22.42,15.16 24.64,15.16 25.67,16.19 35.24,16.19 36.18,15.25 U1.22
  Top 1.016: RC2_1.1 21.46,16.12 C2_1.1 22.1,16.12 v23.69,16.12 | C3_1.2 22.22,20.32 22.62,19.93 v23.69,19.93
  Bottom 1.016: v23.69,16.12 v23.69,19.93
C3_1  (via drill 0.55 pad 1.1)
  Top 0.203: C3_1.1 22.54,21.59 24.76,21.59 25.72,22.54 30.16,22.54 36.45,16.25 U1.20
  Top 1.016: RC3_1.1 21.59,22.54 C3_1.1 22.23,22.54 v23.81,22.54 | C4_1.2 22.23,26.35 v23.81,26.35
  Bottom 1.016: v23.81,22.54 v23.81,26.35
C4_1  (via drill 0.55 pad 1.1)
  Top 0.203: C4_1.1 22.54,27.94 24.76,27.94 25.72,28.89 27.28,28.89 28.08,28.09 28.08,25.9 36.72,17.25 U1.18
  Top 1.016: RC4_1.1 21.59,28.89 C4_1.1 22.23,28.89 v23.81,28.89
  Top 1.27: C5_1.2 22.23,32.7 v23.81,32.7
  Bottom 1.016: v23.81,28.89 v23.81,32.7
C5_1  (via drill 0.55 pad 1.1)
  Top 0.203: C5_1.1 22.54,34.29 24.76,34.29 25.72,35.24 28.26,35.24 28.89,34.61 28.89,26.32 36.96,18.25 U1.16
  Top 1.016: RC5_1.1 21.59,35.24 C5_1.1 22.23,35.24 v23.81,35.24
  Top 1.27: C6_1.2 22.23,39.05 v23.81,39.05
  Bottom 1.016: v23.81,35.24 v23.81,39.05
C6_1  (via drill 0.55 pad 1.1)
  Top 0.203: C6_1.1 22.54,40.64 24.76,40.64 25.72,41.59 28.88,41.59 29.71,40.77 29.71,26.66 37.11,19.25 U1.14
  Top 1.016: RC6_1.1 21.59,41.59 C6_1.1 22.23,41.59 v23.81,41.59
  Top 1.27: C7_1.2 22.22,45.72 22.54,45.4 v23.81,45.4
  Bottom 1.016: v23.81,41.59 v23.81,45.4
C7_1  (via drill 0.55 pad 1.1)
  Top 0.203: C7_1.1 22.54,46.99 24.76,46.99 25.72,47.94 29.87,47.94 30.7,47.12 30.7,26.96 37.41,20.25 U1.12
  Top 1.016: RC7_1.1 21.59,47.94 C7_1.1 22.23,47.94 v23.81,47.94 | C8_1.2 22.23,51.75 v23.81,51.75
  Bottom 1.016: v23.81,47.94 v23.81,51.75
C8_1  (via drill 0.55 pad 1.1)
  Top 0.203: C8_1.1 22.54,53.34 24.76,53.34 25.72,54.29 30.79,54.29 31.61,53.47 31.61,27.34 37.7,21.25 | U1.10 37.7,21.25 | 37.7,21.25
  Top 1.016: RC8_1.1 21.59,54.29 C8_1.1 22.23,54.29 v23.81,54.29
  Top 1.27: C9_1.2 22.23,58.1 v23.81,58.1
  Bottom 1.016: v23.81,54.29 v23.81,58.1
C9_1  (via drill 0.55 pad 1.1)
  Top 0.203: C9_1.1 22.54,59.69 24.76,59.69 25.72,60.64 31.78,60.64 32.6,59.82 32.6,27.64 37.99,22.25 U1.8
  Top 1.016: RC9_1.1 21.59,60.64 C9_1.1 22.23,60.64 v23.81,60.64 | C10_1.2 22.23,64.45 v23.81,64.45
  Bottom 1.016: v23.81,60.64 v23.81,64.45
C10_1  (via drill 0.55 pad 1.1)
  Top 0.203: C10_1.1 22.54,66.04 24.76,66.04 25.72,66.99 32.25,66.99 33.52,65.72 33.52,28.02 38.28,23.25 U1.6
  Top 1.016: RC10_1.1 21.59,66.99 C10_1.1 22.23,66.99 v23.81,66.99
  Top 1.27: C11_1.2 22.22,71.12 22.54,70.8 v23.81,70.8
  Bottom 1.016: v23.81,66.99 v23.81,70.8
C11_1  (via drill 0.55 pad 1.1)
  Top 0.203: C11_1.1 22.54,72.39 24.76,72.39 25.72,73.34 33.68,73.34 34.51,72.52 34.51,28.32 38.58,24.25 U1.4
  Top 1.016: RC11_1.1 21.59,73.34 C11_1.1 22.23,73.34 v23.81,73.34 | C12_1.2 22.23,77.15 v23.81,77.15
  Bottom 1.016: v23.81,73.34 v23.81,77.15
C12_1
  Top 0.203: C12_1.1 22.54,78.74 24.76,78.74 25.72,79.69 34.6,79.69 35.42,78.87 35.42,28.7 38.87,25.25 U1.2
  Top 1.016: RC12_1.1 21.59,79.69 C12_1.1
C_IN0_1  (via drill 0.55 pad 1.1)
  Top 0.203: RL1_1.1 1.15,6.47 3.13,4.49 L1.1 12.65,4.49 13.02,4.13 R16.2
  Top 1.27: MOLEX_SL_70553-0012_13PIN.1 -19.37,31.43 -17.46,29.53 -17.46,11.11 -14.85,8.5 -14.77,8.57 -9.21,8.57 | v-6.67,8.57 -6.59,8.5 | v-6.67,8.57 -6.74,8.5 RL1_1.1 | v-6.67,8.57 v-7.94,8.57 -9.21,8.57 | D1.A -9.21,8.57
  Bottom 1.27: -6.59,8.5 v-6.67,8.57
  pour Bottom (no thermals): -4.89,9.77 -4.89,10.4 -18.22,10.4 -18.22,6.59 -4.89,6.59
C_IN1_1  (via drill 0.55 pad 1.1)
  Top 1.016: RC1_1.2 14.31,9.77 T1_3.C 11.77,11.67 2.73,11.67 1.15,13.26 RL2_1.1
  Top 1.27: RL2_1.1 v-7.94,14.92 -8.06,14.79 D1.C -9.85,14.29 -13.02,14.29 -15.56,16.83 -15.56,32.07 -17.46,33.97 MOLEX_SL_70553-0012_13PIN.2
  Bottom 1.27: v-7.94,14.92 RB2_1.2
  other vias: -6.67,14.92
  pour Bottom (no thermals): -4.89,16.75 -18.22,16.75 -18.22,12.94 -4.89,12.94
C_IN2_1  (via drill 0.55 pad 1.1)
  Top 1.016: RC2_1.2 14.31,16.12 T1_4.C 11.77,18.02 2.73,18.02 1.27,19.48 RL3_1.1
  Top 1.27: MOLEX_SL_70553-0012_13PIN.3 -15.56,36.51 -13.65,34.61 -13.65,24.45 -10.48,21.27 v-7.94,21.27 RL3_1.1
  other vias: -6.67,21.27
  pour Bottom (no thermals): -4.76,22.54 -4.76,23.18 -18.1,23.18 -18.1,19.37 -4.76,19.37
C_IN3_1  (via drill 0.55 pad 1.1)
  Top 1.016: RC3_1.2 14.44,22.54 T1_7.C 11.89,24.45 2.86,24.45 1.27,26.03 RL4_1.1
  Top 1.27: MOLEX_SL_70553-0012_13PIN.4 -13.65,39.05 -11.75,37.15 -11.75,30.16 -9.21,27.62 v-7.94,27.62 RL4_1.1
  other vias: -6.67,27.62
  pour Bottom (no thermals): -4.76,29.53 -18.1,29.53 -18.1,25.72 -4.76,25.72
C_IN4_1  (via drill 0.55 pad 1.1)
  Top 1.016: RC4_1.2 14.44,28.89 T1_8.C 11.89,30.8 2.86,30.8 1.27,32.38 RL5_1.1
  Top 1.27: MOLEX_SL_70553-0012_13PIN.5 -11.75,41.59 -9.84,39.69 -9.84,35.88 v-7.94,33.97 RL5_1.1
  other vias: -6.67,33.97
  pour Bottom (no thermals): -4.76,35.24 -4.76,35.88 -18.1,35.88 -18.1,32.07 -4.76,32.07
C_IN5_1  (via drill 0.55 pad 1.1)
  Top 1.016: RC5_1.2 14.44,35.24 T1_5.C 11.89,37.15 2.86,37.15 1.27,38.73 RL6_1.1
  Top 1.27: MOLEX_SL_70553-0012_13PIN.6 -9.84,44.13 -7.94,42.23 v-7.94,40.32 RL6_1.1
  other vias: -6.67,40.32
  pour Bottom (no thermals): -4.76,42.23 -18.1,42.23 -18.1,38.42 -4.76,38.42
C_IN6_1  (via drill 0.55 pad 1.1)
  Top 1.016: RC6_1.2 14.44,41.59 T1_6.C 11.89,43.5 2.86,43.5 1.27,45.08 RL7_1.1
  Top 1.27: MOLEX_SL_70553-0012_13PIN.7 v-6.67,46.67 | RL7_1.1 v-6.67,46.67 | v-7.94,46.67 v-6.67,46.67
  pour Bottom (no thermals): -4.76,47.94 -4.76,48.58 -18.1,48.58 -18.1,44.77 -4.76,44.77
C_IN7_1  (via drill 0.55 pad 1.1)
  Top 1.016: RC7_1.2 14.44,47.94 T1_9.C 11.89,49.85 2.86,49.85 1.27,51.43 RL8_1.1
  Top 1.27: v-6.67,53.02 -7.94,51.75 -7.94,51.12 -9.84,49.21 MOLEX_SL_70553-0012_13PIN.8 | RL8_1.1 v-6.67,53.02 | v-7.3,52.39 v-6.67,53.02
  pour Bottom (no thermals): -4.76,54.93 -18.1,54.93 -18.1,51.12 -4.76,51.12
C_IN8_1  (via drill 0.55 pad 1.1)
  Top 1.016: RC8_1.2 14.44,54.29 T1_10.C 11.89,56.2 2.86,56.2 1.27,57.78 RL9_1.1
  Top 1.27: v-6.67,59.37 -9.84,56.2 -9.84,53.66 -11.75,51.75 MOLEX_SL_70553-0012_13PIN.9 | RL9_1.1 v-6.67,59.37 | v-7.3,58.74 v-6.67,59.37
  pour Bottom (no thermals): -4.76,60.64 -4.76,61.28 -18.1,61.28 -18.1,57.47 -4.76,57.47
C_IN9_1  (via drill 0.55 pad 1.1)
  Top 1.016: RC9_1.2 14.44,60.64 T1_11.C 11.89,62.55 2.86,62.55 1.27,64.13 RL10_1.1
  Top 1.27: MOLEX_SL_70553-0012_13PIN.10 -13.65,54.29 -11.75,56.2 -11.75,63.82 -9.84,65.72 v-7.94,65.72 v-6.67,65.72 RL10_1.1
  pour Bottom (no thermals): -4.76,67.63 -18.1,67.63 -18.1,63.82 -4.76,63.82
C_IN10_1  (via drill 0.55 pad 1.1)
  Top 1.016: RC10_1.2 14.44,66.99 T1_12.C 11.89,68.9 2.86,68.9 1.27,70.48 RL11_1.1
  Top 1.27: RL11_1.1 v-6.67,72.07 v-7.94,72.07 -13.02,72.07 -13.65,71.44 -13.65,58.74 -15.56,56.83 MOLEX_SL_70553-0012_13PIN.11
  Bottom 1.27: v-7.94,72.07 RB11_1.2
  pour Bottom (no thermals): -4.76,73.34 -4.76,73.98 -18.1,73.98 -18.1,70.17 -4.76,70.17
C_IN11_1  (via drill 0.55 pad 1.1)
  Top 1.016: RC11_1.2 14.44,73.34 T1_13.C 11.89,75.25 2.86,75.25 1.27,76.83 RL12_1.1
  Top 1.27: MOLEX_SL_70553-0012_13PIN.12 -17.46,59.37 -15.56,61.28 -15.56,77.79 -14.92,78.42 v-7.94,78.42 v-6.67,78.42 RL12_1.1
  pour Bottom (no thermals): -4.76,80.33 -18.1,80.33 -18.1,76.52 -4.76,76.52
C_IN12_1
  Top 0.203: R4.2 37.47,37.46 35.83,39.1 35.83,79.04 33.97,80.89 33.97,80.96 33.34,81.6 18.1,81.6 17.15,80.65 RC12_1.2
  Top 0.254: R3.2 R4.2
  Top 1.016: RC12_1.2 14.44,79.69 T1_14.C 11.26,82.23
  Top 1.27: 11.26,82.23 -16.83,82.23 -17.46,81.6 -17.46,63.82 -19.37,61.91 MOLEX_SL_70553-0012_13PIN.13
CS  (via drill 0.55 pad 1.1)
  Top 0.254: MOLEX_SL_5.2 67.63,12.38 68.26,13.02 68.26,32.07 67.63,32.7 v64.45,32.7 R8.2
  Bottom 0.254: 63.82,37.78 63.82,33.34 v64.45,32.7 | JP1.3 53.02,44.77 54.93,42.86 58.74,42.86
  Bottom 0.305: 63.82,37.78 58.74,42.86
CS_OR_IMA
  Top 0.254: U1.41 56.39,22.25 56.83,22.69 56.83,44.13 55.56,45.4 55.56,47.94 54.93,48.58 JP1.2
DRIVE
  Top 0.254: U1.38 50.24,20.75 52.9,18.1 52.9,12.38 53.61,11.67 DZT5551-13.B
DTEN  (via drill 0.55 pad 1.1)
  Top 0.254: U1.36 49.16,19.75 v50.33,18.58 | v54.93,19.37 56.83,19.37 59.37,21.91 59.37,42.86 60.64,44.13 66.99,44.13 67.63,44.77 67.63,47.94 66.99,48.58 JP4.2
  Bottom 0.254: v54.93,19.37 54.14,18.58 v50.33,18.58
IBIAS
  Top 0.254: U1.45 45.77,24.25 45.49,24.53 45.49,31.2 R1.2
ICMP
  Top 0.254: R2.2 R1.1 | 49.85,37.15 50.48,36.51 50.48,33.34 46.04,28.89 46.04,25.02 46.26,24.8 46.99,24.8 U1.46
  Top 0.305: 49.85,37.15 R1.1
IMB
  Top 0.254: U1.47 53.19,25.25 | 43.5,42.86 42.23,44.13 42.23,53.66 | R6.1 42.54,56.51 43.5,57.47 43.5,61.28 40.32,64.45 40.32,72.71 41.88,74.26 U$1.9
  Top 0.305: 53.19,25.25 54.29,26.35 54.29,40.32 51.75,42.86 43.5,42.86 | R6.1 42.23,53.66
IPB
  Top 0.254: U1.48 52.35,25.75 | 53.02,39.05 50.48,41.59 42.86,41.59 40.64,43.81 R6.2 40.64,56.51 37.78,59.37 37.78,75.88 40.16,78.26 U$1.7
  Top 0.305: 52.35,25.75 53.02,26.42 53.02,39.05
ISO_OUTM_1
  Top 0.254: 1.1 65.72,80.96 63.02,78.26 U$1.6
ISO_OUTP_1
  Top 0.254: 2.1 69.53,79.06 64.74,74.26 U$1.4
ISOMD
  Top 0.254: U1.40 57.31,21.75 58.1,22.54 58.1,44.14 56.83,45.41 56.83,47.94 57.47,48.58 JP3.2
N$3
  Top 0.254: C6.1 41.59,61.59 39.05,64.13 39.05,74.61 40.7,76.26 U$1.8
N$5
  Top 0.254: C1.1 40,33.97 40,32.07 | 39.96,30.84 U1.1
  Top 0.305: 40,32.07 R3.1 39.96,30.84
N$7
  Top 0.254: JP2.1 46.55,53.77 R9.2 46.99,56.51 45.4,58.1 45.4,61.28 41.59,65.09 41.59,71.44 42.42,72.26 U$1.10
N$8
  Top 0.254: JP1.1 53.02,53.02 51.75,54.29 R9.1 48.89,56.51 49.85,57.47 49.85,61.28 44.69,66.44 44.69,68.18 U$1.12
N$9
  Top 0.254: C7.1 47.94,60.64 42.86,65.72 42.86,69.53 43.59,70.26 U$1.11
N$32  (via drill 0.55 pad 1.1)
  Top 1.27: LED1_11.2 v9.33,59.37 T1_11.E
  Bottom 1.27: v9.33,59.37 RB9_1.1
  other vias: 10.48,59.37
  pour Bottom (no thermals): 7.94,61.28 20,61.28 20,57.47 7.94,57.47
N$33
  Top 1.016: T1_11.G 14.44,58.1 RS9_1.2
N$34
  Top 1.016: RL9_1.2 LED1_11.1
N$35  (via drill 0.55 pad 1.1)
  Top 1.27: LED1_12.2 v9.33,65.72 T1_12.E
  Bottom 1.27: v9.33,65.72 RB10_1.1
  other vias: 10.48,65.72
  pour Bottom (no thermals): 7.94,67.63 20,67.63 20,63.82 7.94,63.82
N$36
  Top 1.016: T1_12.G 14.44,64.45 RS10_1.2
N$37
  Top 1.016: RL10_1.2 LED1_12.1
N$39  (via drill 0.55 pad 1.1)
  Top 1.27: LED1_13.2 v9.33,72.07 T1_13.E
  Bottom 1.27: v9.33,72.07 RB11_1.1
  other vias: 10.48,72.07
  pour Bottom (no thermals): 7.94,73.98 20,73.98 20,70.17 7.94,70.17
N$40  (via drill 0.55 pad 1.1)
  Top 1.27: LED1_3.2 v9.21,8.5 T1_3.E
  Bottom 1.27: v9.21,8.5 RB1_1.1
  other vias: 10.35,8.5
  pour Bottom (no thermals): 7.81,10.4 19.88,10.4 19.88,6.59 7.81,6.59
N$41
  Top 1.016: T1_3.G 14.31,7.23 RS1_1.2
N$42
  Top 1.016: RL1_1.2 LED1_3.1
N$43  (via drill 0.55 pad 1.1)
  Top 1.27: LED1_4.2 7.79,14.72 v9.21,14.72 11.66,14.72 T1_4.E
  Bottom 1.27: v9.21,14.72 5.59,14.72 RB2_1.1
  other vias: 10.35,14.72
  pour Bottom (no thermals): 7.81,16.75 19.88,16.75 19.88,12.94 7.81,12.94
N$44
  Top 1.016: T1_4.G 14.31,13.58 RS2_1.2
N$45
  Top 1.016: RL2_1.2 LED1_4.1
N$48  (via drill 0.55 pad 1.1)
  Top 1.27: LED1_5.2 v9.33,33.97 T1_5.E
  Bottom 1.27: v9.33,33.97 RB5_1.1
  other vias: 10.48,33.97
  pour Bottom (no thermals): 7.94,35.88 20,35.88 20,32.07 7.94,32.07
N$49
  Top 1.016: T1_5.G 14.44,32.7 RS5_1.2
N$50
  Top 1.016: RL5_1.2 LED1_5.1
N$51  (via drill 0.55 pad 1.1)
  Top 1.27: LED1_6.2 v9.33,40.32 T1_6.E
  Bottom 1.27: v9.33,40.32 RB6_1.1
  other vias: 10.48,40.32
  pour Bottom (no thermals): 7.94,42.23 20,42.23 20,38.42 7.94,38.42
N$52
  Top 1.016: T1_6.G 14.44,39.05 RS6_1.2
N$53
  Top 1.016: RL6_1.2 LED1_6.1
N$55  (via drill 0.55 pad 1.1)
  Top 1.27: LED1_9.2 v9.33,46.67 T1_9.E
  Bottom 1.27: v9.33,46.67 RB7_1.1
  other vias: 10.48,46.67
  pour Bottom (no thermals): 7.94,48.58 20,48.58 20,44.77 7.94,44.77
N$56  (via drill 0.55 pad 1.1)
  Top 1.27: LED1_7.2 v9.33,21.27 T1_7.E
  Bottom 1.27: v9.33,21.27 RB3_1.1
  other vias: 10.48,21.27
  pour Bottom (no thermals): 7.94,23.18 20,23.18 20,19.37 7.94,19.37
N$57
  Top 1.016: T1_7.G 14.44,20 RS3_1.2
N$58
  Top 1.016: RL3_1.2 LED1_7.1
N$59  (via drill 0.55 pad 1.1)
  Top 1.27: LED1_8.2 v9.33,27.62 T1_8.E
  Bottom 1.27: v9.33,27.62 RB4_1.1
  other vias: 10.48,27.62
  pour Bottom (no thermals): 7.94,29.53 20,29.53 20,25.72 7.94,25.72
N$60
  Top 1.016: T1_8.G 14.44,26.35 RS4_1.2
N$61
  Top 1.016: RL4_1.2 LED1_8.1
N$62
  Top 1.016: T1_13.G 14.44,70.8 RS11_1.2
N$63
  Top 1.016: T1_9.G 14.44,45.4 RS7_1.2
N$64
  Top 1.016: RL7_1.2 LED1_9.1
N$65  (via drill 0.55 pad 1.1)
  Top 1.27: LED1_10.2 v9.33,53.02 T1_10.E
  Bottom 1.27: v9.33,53.02 RB8_1.1
  other vias: 10.48,53.02
  pour Bottom (no thermals): 7.94,54.93 20,54.93 20,51.12 7.94,51.12
N$66
  Top 1.016: T1_10.G 14.44,51.75 RS8_1.2
N$67
  Top 1.016: RL8_1.2 LED1_10.1
N$69
  Top 1.016: RL11_1.2 LED1_13.1
N$70  (via drill 0.55 pad 1.1)
  Top 1.27: LED1_14.2 v9.33,78.42 T1_14.E
  Bottom 1.27: v9.33,78.42 RB12_1.1
  other vias: 10.48,78.42
  pour Bottom (no thermals): 7.94,80.33 20,80.33 20,76.52 7.94,76.52
N$71
  Top 1.016: T1_14.G 14.44,77.15 RS12_1.2
N$72
  Top 1.016: RL12_1.2 LED1_14.1
S1_1
  Top 0.203: RS1_1.1 19.56,6.59 19.88,6.59 20.51,5.96 24.32,5.96 24.96,6.59 24.96,8.5 25.67,9.21 33.92,9.21 33.95,9.23 35.47,10.75 35.47,13.25 35.88,13.65 37.15,13.65 38.42,12.38 46.67,12.38 47.31,13.02 47.31,13.98 U1.25
S2_1
  Top 0.203: RS2_1.1 19.56,12.94 19.88,12.94 20.51,12.31 24.32,12.31 24.96,12.94 24.96,14.85 25.59,15.48 25.67,15.56 35.3,15.56 36.03,14.83 39.88,14.83 U1.23
S3_1
  Top 0.203: RS3_1.1 19.68,19.37 20,19.37 20.64,18.73 24.45,18.73 25.08,19.37 25.08,21.27 25.72,21.91 30.16,21.91 36.32,15.75 U1.21
S4_1
  Top 0.203: RS4_1.1 19.68,25.72 20,25.72 20.64,25.08 24.45,25.08 25.08,25.72 25.08,27.62 25.72,28.26 26.99,28.26 27.62,27.62 27.62,25.72 36.59,16.75 U1.19
S5_1
  Top 0.203: RS5_1.1 19.68,32.07 20,32.07 20.64,31.43 24.45,31.43 25.08,32.07 25.08,33.97 25.72,34.61 27.85,34.61 28.49,33.97 28.49,26.15 36.89,17.75 U1.17
S6_1
  Top 0.203: RS6_1.1 19.68,38.42 20,38.42 20.64,37.78 24.45,37.78 25.08,38.42 25.08,40.32 25.72,40.96 28.89,40.96 29.3,40.55 29.3,26.49 37.06,18.73 39.94,18.73 U1.15
S7_1
  Top 0.203: RS7_1.1 19.68,44.77 20,44.77 20.64,44.13 24.45,44.13 25.08,44.77 25.08,46.67 25.72,47.31 29.53,47.31 30.16,46.67 30.16,26.85 37.26,19.75 U1.13
S8_1
  Top 0.203: RS8_1.1 19.68,51.12 20,51.12 20.64,50.48 24.45,50.48 25.08,51.12 25.08,53.02 25.72,53.66 30.52,53.66 31.15,53.02 31.15,27.15 37.55,20.75 U1.11
S9_1
  Top 0.203: RS9_1.1 19.68,57.47 20,57.47 20.64,56.83 24.45,56.83 25.08,57.47 25.08,59.37 25.72,60.01 31.43,60.01 32.07,59.37 32.07,27.53 37.85,21.75 | U1.9 37.85,21.75 | 37.85,21.75
S10_1
  Top 0.203: RS10_1.1 19.68,63.82 20,63.82 20.64,63.18 24.45,63.18 25.08,63.82 25.08,65.72 25.72,66.36 31.79,66.36 33.06,65.09 33.06,27.83 38.14,22.75 U1.7
S11_1
  Top 0.203: RS11_1.1 19.68,70.17 20,70.17 20.64,69.53 24.45,69.53 25.08,70.17 25.08,72.07 25.72,72.71 33.34,72.71 33.97,72.07 33.97,28.21 38.41,23.78 39.93,23.78 U1.5
S12_1
  Top 0.203: RS12_1.1 19.68,76.52 20,76.52 20.64,75.88 24.45,75.88 25.08,76.52 25.08,78.42 25.72,79.06 34.33,79.06 34.96,78.42 34.96,28.51 38.7,24.78 39.93,24.78 U1.3
SCK  (via drill 0.55 pad 1.1)
  Top 0.254: v63.18,31.43 61.91,30.16 R5.2 | MOLEX_SL_5.1 66.99,14.92 67.63,15.56 67.63,30.82 67.02,31.43 v65.75,31.43
  Bottom 0.254: v65.75,31.43 v63.18,31.43 63.18,37.15 58.1,42.23 47.94,42.23 46.55,43.62 JP2.3
SCK_OR_IPA
  Top 0.254: U1.42 55.14,22.75 55.56,23.18 55.56,41.59 | 53.02,44.13 50.48,44.13 49.21,45.4 49.21,47.94 48.58,48.58 JP2.2
  Top 0.305: 55.56,41.59 53.02,44.13
SDI  (via drill 0.55 pad 1.1)
  Top 0.203: U1.43 47.08,23.21
  Top 0.254: v54.29,23.81 53.66,23.21 47.08,23.21 | MOLEX_SL_5.4 63.18,7.3 61.91,8.57 61.91,17.46 64.45,20 65.4,20 R7.2 65.4,23.5 65.09,23.81 v64.45,23.81
  Bottom 0.305: v54.29,23.81 v64.45,23.81
SDO  (via drill 0.55 pad 1.1)
  Top 0.254: U1.44 47.06,23.78 52.99,23.78 v54.29,25.08 | v64.45,25.08 66.36,25.08 66.99,24.45 66.99,19.37 66.36,18.73 64.45,18.73 62.55,16.83 62.55,10.48 63.18,9.84 MOLEX_SL_5.3
  Bottom 0.305: v54.29,25.08 v64.45,25.08
V-_1  (via drill 0.55 pad 1.1)
  Top 0.152: 47.98,58.38 C7.2
  Top 0.254: U1.31 U1.30 | C1.2 v42.86,33.34
  Top 0.305: U1.30 47.99,16.75 | C5.2 51.12,4.19
  Top 0.508: 51.12,4.19 C4.2 C3.2 C2.2 63.25,4.19 MOLEX_SL_5.5 | R2.1 C1.2 | 47.99,16.75 49.21,15.59 49.21,4.76 | 49.21,4.76 49.85,4.13 51.12,4.19 | C6.2 v41.59,56.2 | v47.98,56.2 47.98,58.38 | 51.12,4.19 49.47,2.54 C8.2 21.73,2.37 L1.2 | 49.21,4.76 v48.58,4.13
  pour Bottom: 26.99,82.23 55.56,82.23 55.56,64.91 70.8,64.91 70.8,-2.22 26.99,-2.22
VREF1_C4
  Top 0.254: U1.35 47.06,19.23 48.34,19.23 51.37,16.19 51.37,10.73 54.17,7.94 C4.1
VREF2_C5
  Top 0.254: U1.34 47.06,18.73 47.83,18.73 47.83,18.72 50.61,15.94 50.61,6.47 C5.1
VREG  (via drill 0.55 pad 1.1)
  Top 0.254: JP4.1 JP3.1 | 57.34,10 DZT5551-13.E 59.01,10.21 v60.01,9.21 | 57.34,10 C3.1 | U1.37 47.06,20.23 49.95,20.23 52.13,18.05 52.13,11.24 53.37,10 57.34,10 | 61.28,26.99 60.64,27.62 60.64,33.97 61.28,34.61 67.63,34.61 | 63.18,21.27 61.91,21.27 v61.91,19.37
  Top 0.305: R8.1 R5.1 | JP4.1 66.99,51.12 68.26,49.85 68.26,35.24 67.63,34.61 | R5.1 61.91,21.27 | R7.1 63.18,21.27 | R5.1 61.28,26.99
  Bottom 0.254: v61.91,19.37 60.01,17.46 v60.01,9.21
VREG_CAP  (via drill 0.55 pad 1.1)
  Top 0.254: 61.15,17.21 61.15,6.09 | 54.9,17.49 v51.75,20.64 | 51.75,37.78 49.21,40.32 41.59,40.32 39.69,38.42 39.69,36.51
  Top 0.305: DZT5551-13.C 60.79,17.57 61.15,17.21 | 61.15,6.09 C2.1 | DZT5551-13.C@2 DZT5551-13.C | DZT5551-13.C 54.9,17.49 | v51.75,26.99 51.75,37.78 | R4.1 39.69,36.51
  Bottom 0.305: v51.75,20.64 v51.75,26.99
XOUT1_1
  Top 0.254: U$1.1 60.01,68.26 60.64,68.9 MOLEX_SL_2.2
XOUT3_1
  Top 0.254: U$1.3 59.09,72.07 60.01,72.07 60.64,71.44 MOLEX_SL_2.1

### Text on the board
tPlace: M3 Screw. Major Diam: .115 in | 1 | 1 | 1 | 1 | 0 | 0 | 0 | 0 | JP2 | JP1 | JP3 | JP4